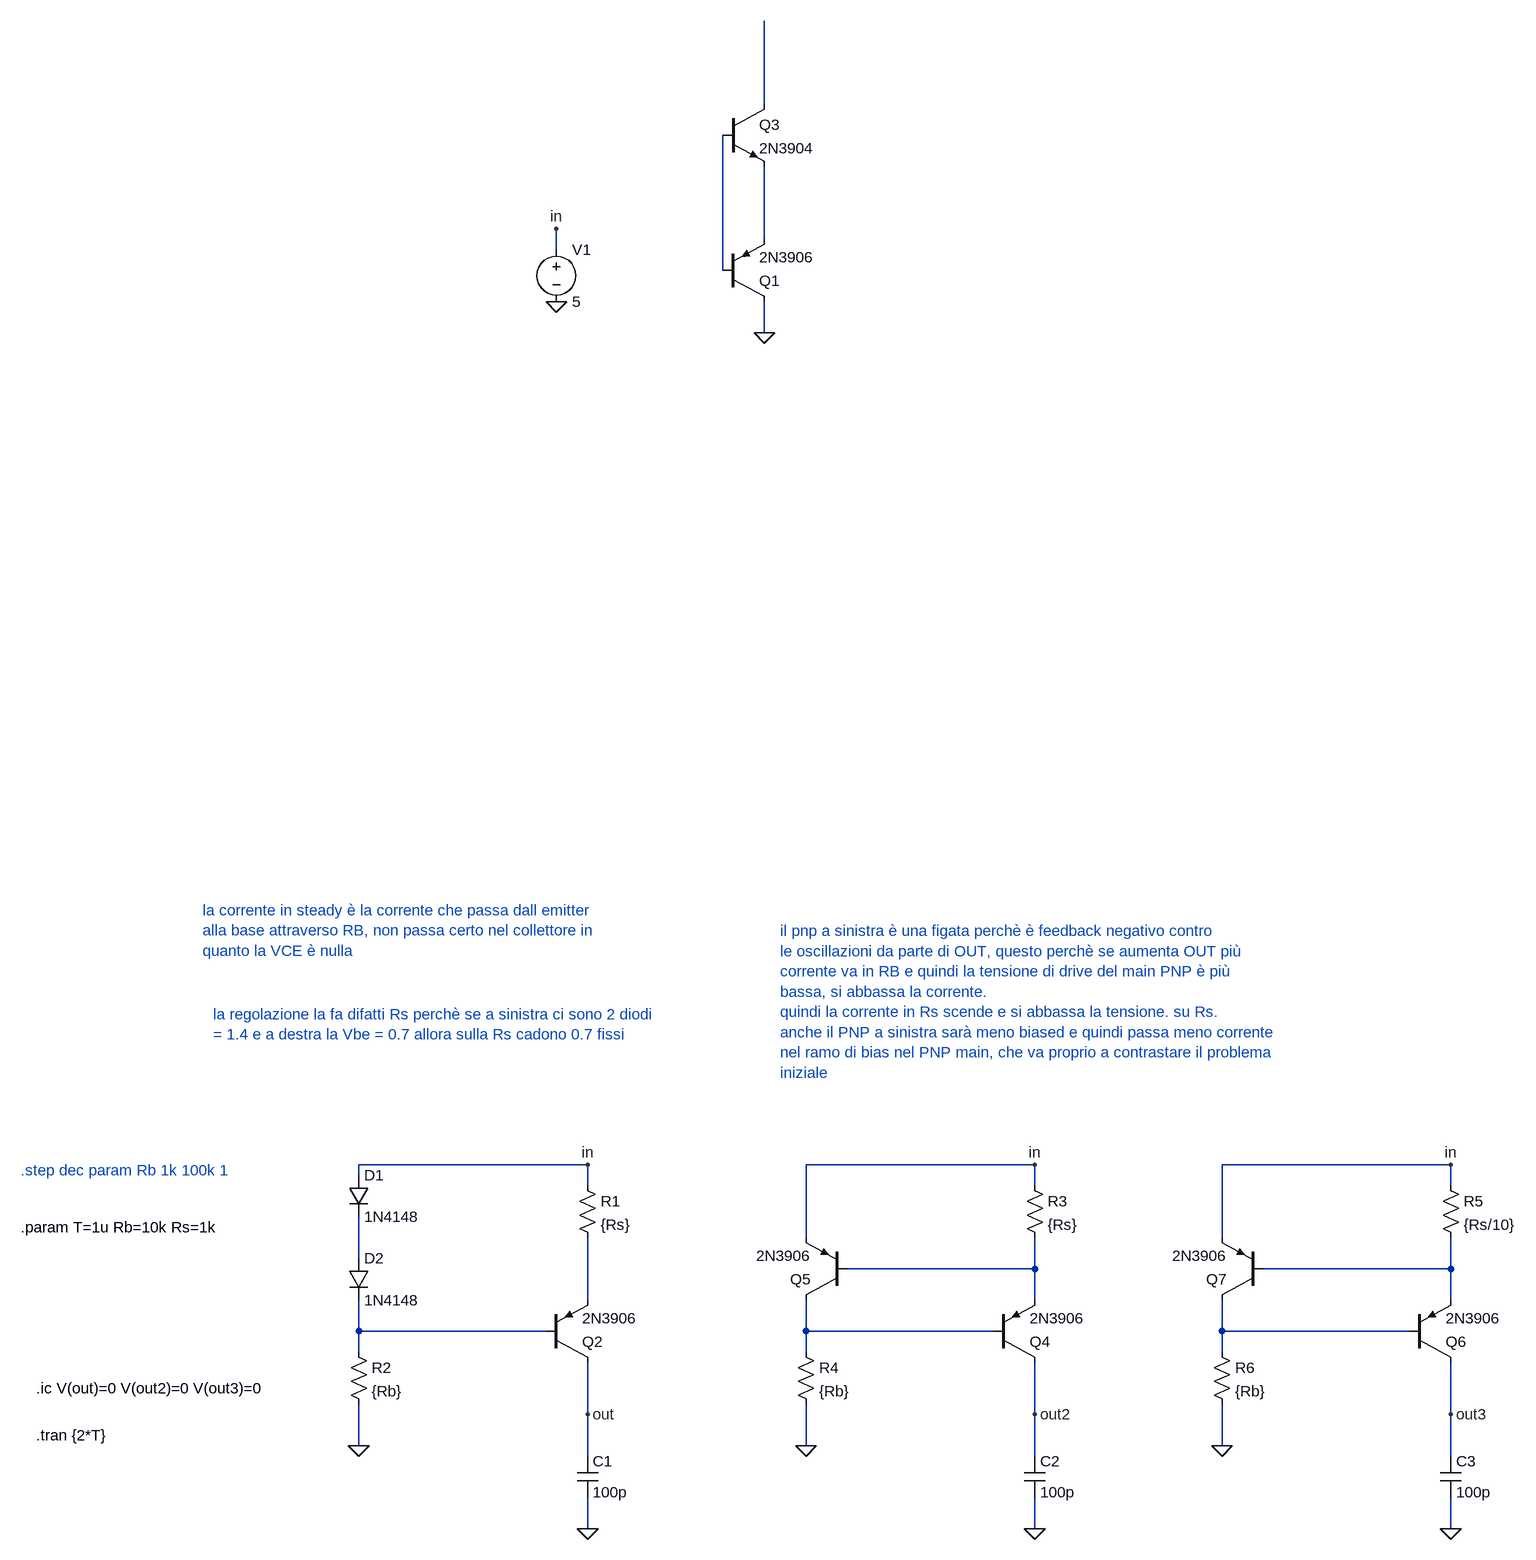
[diagram p0: schematic current source.asc]
current source.asc, the LTspice schematic file:
Version 4.1
SHEET 1 2956 1760
WIRE 1776 -1280 1776 -1408
WIRE 1776 -1072 1776 -1184
WIRE 1456 -1056 1456 -1088
WIRE 1712 -1024 1712 -1232
WIRE 1776 -928 1776 -976
WIRE 1504 352 1152 352
WIRE 2192 352 1840 352
WIRE 2832 352 2480 352
WIRE 1152 368 1152 352
WIRE 1504 384 1504 352
WIRE 2192 384 2192 352
WIRE 2832 384 2832 352
WIRE 1840 464 1840 352
WIRE 2480 464 2480 352
WIRE 1152 496 1152 432
WIRE 2192 512 2192 464
WIRE 2192 512 1904 512
WIRE 2832 512 2832 464
WIRE 2832 512 2544 512
WIRE 1504 560 1504 464
WIRE 2192 560 2192 512
WIRE 2832 560 2832 512
WIRE 1152 608 1152 560
WIRE 1440 608 1152 608
WIRE 1840 608 1840 560
WIRE 2128 608 1840 608
WIRE 2480 608 2480 560
WIRE 2768 608 2480 608
WIRE 1152 640 1152 608
WIRE 1840 640 1840 608
WIRE 2480 640 2480 608
WIRE 1504 736 1504 656
WIRE 2192 736 2192 656
WIRE 2832 736 2832 656
WIRE 1152 784 1152 720
WIRE 1840 784 1840 720
WIRE 2480 784 2480 720
WIRE 1504 800 1504 736
WIRE 2192 800 2192 736
WIRE 2832 800 2832 736
WIRE 1504 912 1504 864
WIRE 2192 912 2192 864
WIRE 2832 912 2832 864
FLAG 1456 -976 0
FLAG 1456 -1088 in
FLAG 1504 352 in
FLAG 1152 784 0
FLAG 1504 912 0
FLAG 1504 736 out
FLAG 1776 -928 0
FLAG 2192 352 in
FLAG 1840 784 0
FLAG 2192 912 0
FLAG 2192 736 out2
FLAG 2832 352 in
FLAG 2480 784 0
FLAG 2832 912 0
FLAG 2832 736 out3
SYMBOL voltage 1456 -1072 R0
WINDOW 123 0 0 Left 0
WINDOW 39 0 0 Left 0
SYMATTR InstName V1
SYMATTR Value 5
SYMBOL res 1488 368 R0
SYMATTR InstName R1
SYMATTR Value {Rs}
SYMBOL res 1136 624 R0
SYMATTR InstName R2
SYMATTR Value {Rb}
SYMBOL cap 1488 800 R0
SYMATTR InstName C1
SYMATTR Value 100p
SYMBOL pnp 1440 656 M180
SYMATTR InstName Q2
SYMATTR Value 2N3906
SYMBOL diode 1136 368 R0
SYMATTR InstName D1
SYMATTR Value 1N4148
SYMBOL diode 1136 496 R0
SYMATTR InstName D2
SYMATTR Value 1N4148
SYMBOL pnp 1712 -976 M180
SYMATTR InstName Q1
SYMATTR Value 2N3906
SYMBOL lib\\sym\\npn 1712 -1280 R0
SYMATTR InstName Q3
SYMATTR Value 2N3904
SYMBOL res 2176 368 R0
SYMATTR InstName R3
SYMATTR Value {Rs}
SYMBOL res 1824 624 R0
SYMATTR InstName R4
SYMATTR Value {Rb}
SYMBOL cap 2176 800 R0
SYMATTR InstName C2
SYMATTR Value 100p
SYMBOL pnp 2128 656 M180
SYMATTR InstName Q4
SYMATTR Value 2N3906
SYMBOL pnp 1904 560 R180
SYMATTR InstName Q5
SYMATTR Value 2N3906
SYMBOL res 2816 368 R0
SYMATTR InstName R5
SYMATTR Value {Rs/10}
SYMBOL res 2464 624 R0
SYMATTR InstName R6
SYMATTR Value {Rb}
SYMBOL cap 2816 800 R0
SYMATTR InstName C3
SYMATTR Value 100p
SYMBOL pnp 2768 656 M180
SYMATTR InstName Q6
SYMATTR Value 2N3906
SYMBOL pnp 2544 560 R180
SYMATTR InstName Q7
SYMATTR Value 2N3906
TEXT 656 768 Left 2 !.tran {2*T}
TEXT 632 448 Left 2 !.param T=1u Rb=10k Rs=1k
TEXT 656 696 Left 2 !.ic V(out)=0 V(out2)=0 V(out3)=0
TEXT 632 360 Left 2 ;.step dec param Rb 1k 100k 1
TEXT 912 -40 Left 2 ;la corrente in steady è la corrente che passa dall emitter\nalla base attraverso RB, non passa certo nel collettore in\nquanto la VCE è nulla
TEXT 928 120 Left 2 ;la regolazione la fa difatti Rs perchè se a sinistra ci sono 2 diodi\n= 1.4 e a destra la Vbe = 0.7 allora sulla Rs cadono 0.7 fissi
TEXT 1800 -8 Left 2 ;il pnp a sinistra è una figata perchè è feedback negativo contro\nle oscillazioni da parte di OUT, questo perchè se aumenta OUT più \ncorrente va in RB e quindi la tensione di drive del main PNP è più \nbassa, si abbassa la corrente.\nquindi la corrente in Rs scende e si abbassa la tensione. su Rs.\nanche il PNP a sinistra sarà meno biased e quindi passa meno corrente\nnel ramo di bias nel PNP main, che va proprio a contrastare il problema\niniziale

The netlist it stands for:
* current source.asc
V1 in 0 5
R1 in N007 {Rs}
R2 N008 0 {Rb}
C1 out 0 100p
Q2 out N008 N007 0 2N3906
D1 in N004 1N4148
D2 N004 N008 1N4148
Q1 0 N003 N002 0 2N3906
Q3 N001 N003 N002 0 2N3904
R3 in N005 {Rs}
R4 N009 0 {Rb}
C2 out2 0 100p
Q4 out2 N009 N005 0 2N3906
Q5 N009 N005 in 0 2N3906
R5 in N006 {Rs/10}
R6 N010 0 {Rb}
C3 out3 0 100p
Q6 out3 N010 N006 0 2N3906
Q7 N010 N006 in 0 2N3906
.model D D
.lib standard.dio
.model NPN NPN
.model PNP PNP
.lib standard.bjt
.tran {2*T}
.param T=1u Rb=10k Rs=1k
.ic V(out)=0 V(out2)=0 V(out3)=0
* .step dec param Rb 1k 100k 1
* la corrente in steady è la corrente che passa dall emitter
* alla base attraverso RB, non passa certo nel collettore in
* quanto la VCE è nulla
* la regolazione la fa difatti Rs perchè se a sinistra ci sono 2 diodi
* = 1.4 e a destra la Vbe = 0.7 allora sulla Rs cadono 0.7 fissi
* il pnp a sinistra è una figata perchè è feedback negativo contro
* le oscillazioni da parte di OUT, questo perchè se aumenta OUT più
* corrente va in RB e quindi la tensione di drive del main PNP è più
* bassa, si abbassa la corrente.
* quindi la corrente in Rs scende e si abbassa la tensione. su Rs.
* anche il PNP a sinistra sarà meno biased e quindi passa meno corrente
* nel ramo di bias nel PNP main, che va proprio a contrastare il problema
* iniziale
.backanno
.end